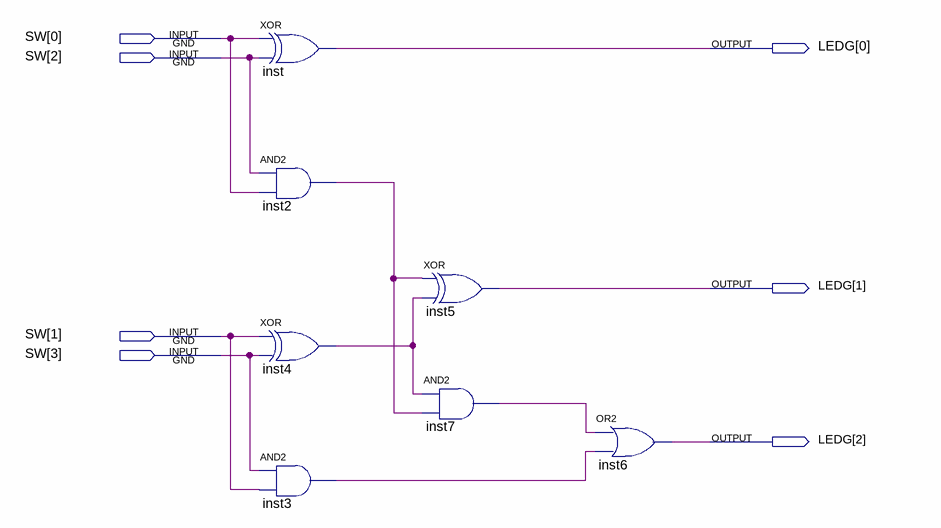
[diagram p0: schematic sheet]
// Quartus schematic Simple_circuit_schematic_entry.bdf as structural Verilog: 7 symbols, 7 pins
module Simple_circuit_schematic_entry (
  input  [3:0] SW,
  output [2:0] LEDG
);

  wire inst2_out, inst3_out, inst4_out, inst7_out;

  xor inst (LEDG[0], SW[0], SW[2]);
  and inst2 (inst2_out, SW[2], SW[0]);
  xor inst4 (inst4_out, SW[1], SW[3]);
  and inst3 (inst3_out, SW[3], SW[1]);
  xor inst5 (LEDG[1], inst2_out, inst4_out);
  and inst7 (inst7_out, inst4_out, inst2_out);
  or inst6 (LEDG[2], inst7_out, inst3_out);
endmodule
